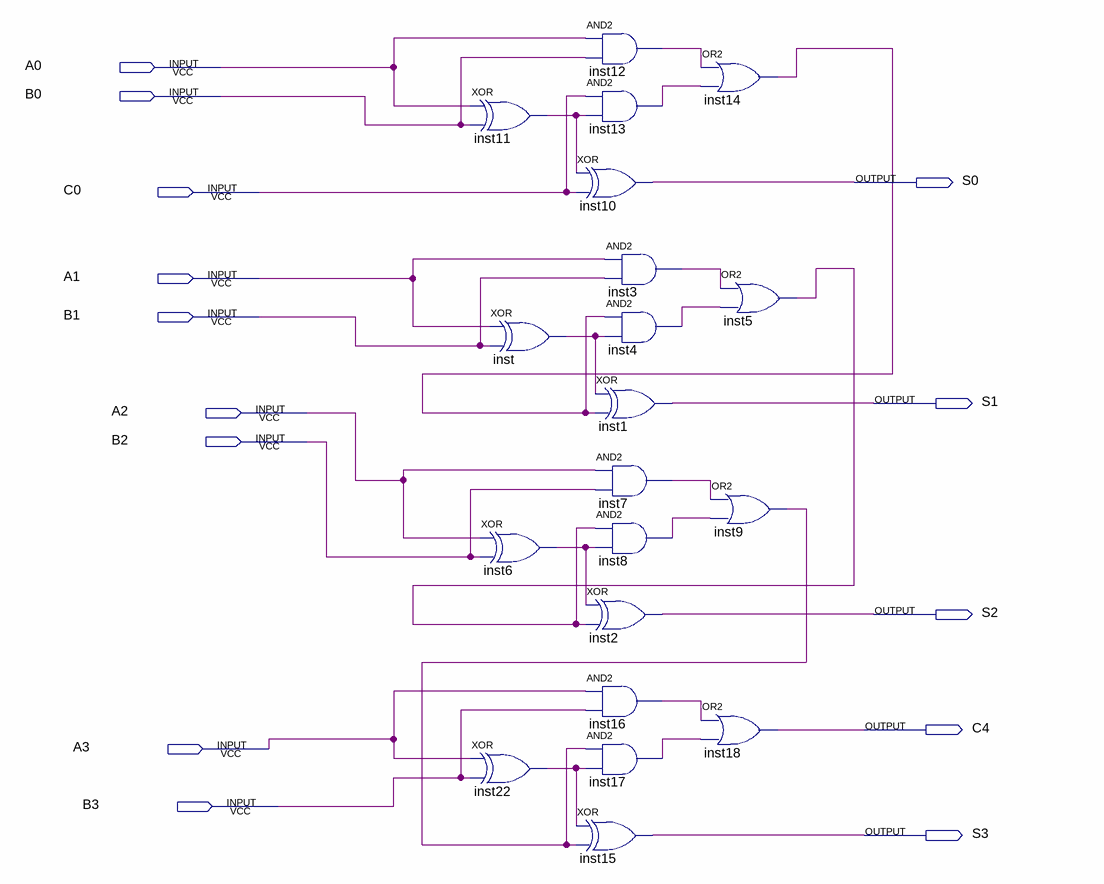
[diagram p0: schematic sheet]
// Quartus schematic design4adder.bdf as structural Verilog: 20 symbols, 14 pins
module design4adder (
  input  A0,
  input  B0,
  input  C0,
  input  A1,
  input  B1,
  input  A2,
  input  B2,
  input  A3,
  input  B3,
  output S0,
  output S1,
  output S2,
  output C4,
  output S3
);

  wire inst3_out, inst4_out, inst5_out, inst6_out, inst7_out, inst8_out, inst9_out, inst11_out, inst12_out,
       inst13_out, inst14_out, inst16_out, inst17_out, inst22_out, inst_out;

  xor inst11 (inst11_out, A0, B0);
  xor inst (inst_out, A1, B1);
  xor inst6 (inst6_out, A2, B2);
  xor inst22 (inst22_out, A3, B3);
  and inst12 (inst12_out, A0, B0);
  and inst13 (inst13_out, C0, inst11_out);
  xor inst10 (S0, inst11_out, C0);
  and inst3 (inst3_out, A1, B1);
  and inst4 (inst4_out, inst14_out, inst_out);
  xor inst1 (S1, inst_out, inst14_out);
  and inst7 (inst7_out, A2, B2);
  and inst8 (inst8_out, inst5_out, inst6_out);
  xor inst2 (S2, inst6_out, inst5_out);
  and inst16 (inst16_out, A3, B3);
  and inst17 (inst17_out, inst9_out, inst22_out);
  xor inst15 (S3, inst22_out, inst9_out);
  or inst14 (inst14_out, inst12_out, inst13_out);
  or inst5 (inst5_out, inst3_out, inst4_out);
  or inst9 (inst9_out, inst7_out, inst8_out);
  or inst18 (C4, inst16_out, inst17_out);
endmodule
